# Altium project FM_TX.PrjPcb
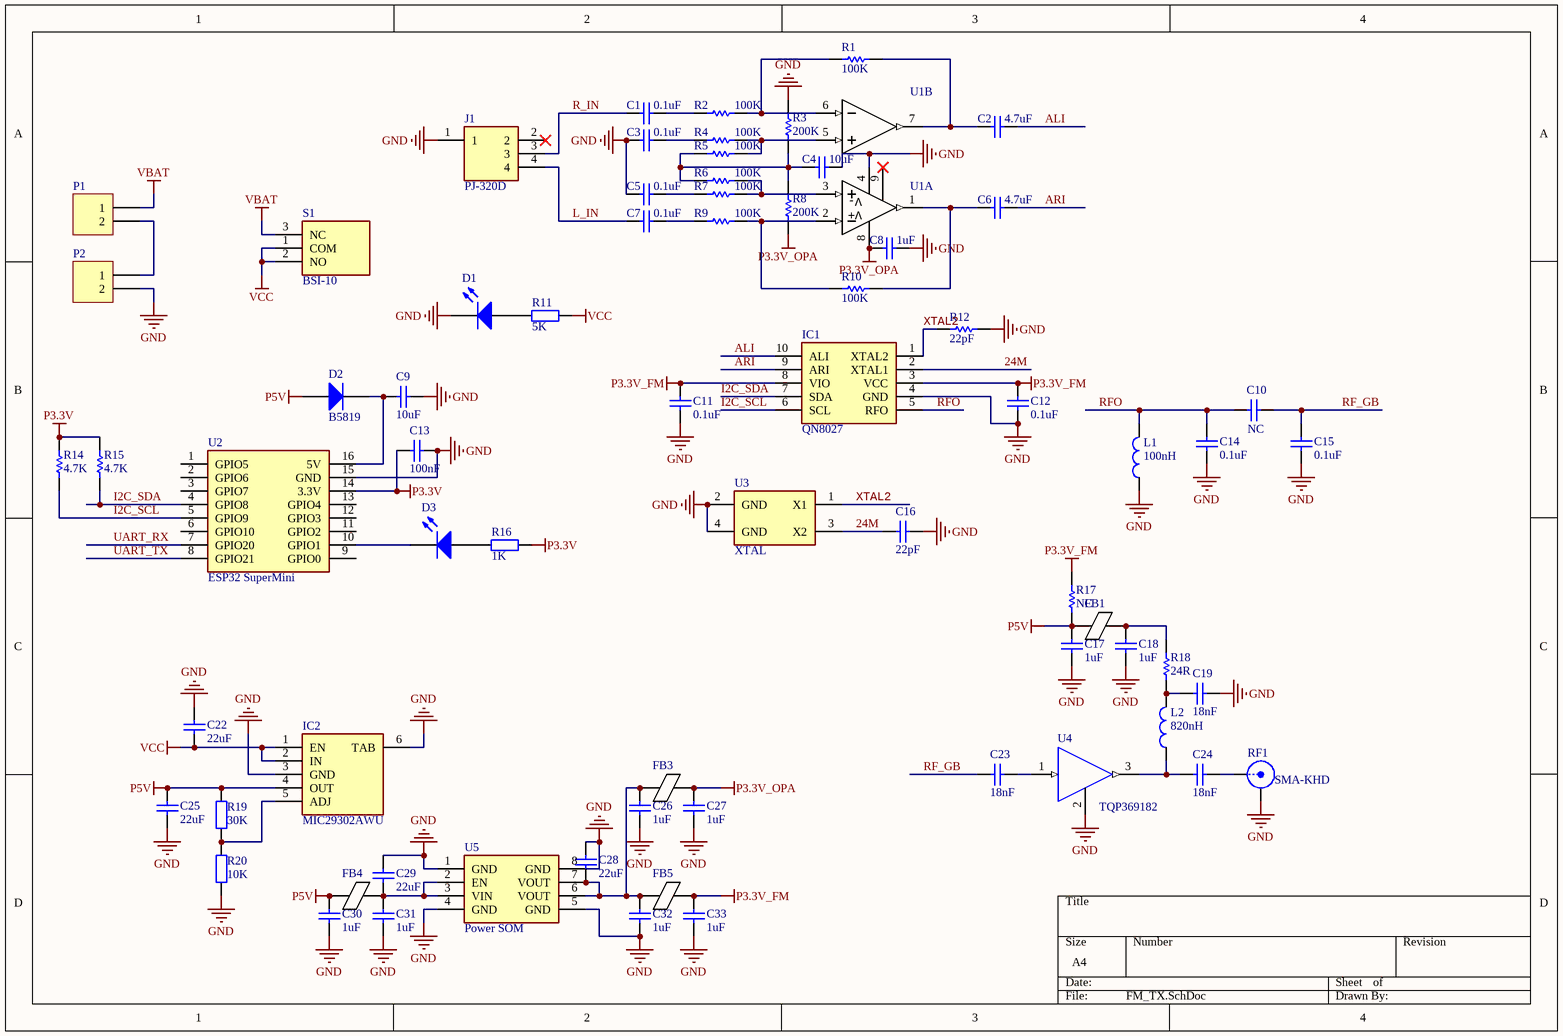
[diagram p0: FM_TX.SchDoc]
1 sheet, 71 parts. Net scope: global (net labels, ports and power ports of the same name join across sheets).
Board file: FM_TX.PcbDoc

## Sheet FM_TX.SchDoc
size A4; SheetNumber: 1; SheetTotal: 1

### Parts
C1  0.1uF  [0603_C]
C2  4.7uF  [0603_C]
C3  0.1uF  [0603_C]
C4  10uF  [0603_C]
C5  0.1uF  [0603_C]
C6  4.7uF  [0603_C]
C7  0.1uF  [0603_C]
C8  1uF  [0603_C]
C9  value 10uF  [C1210]  (hidden comment: Cap)
C10  NC  [0603_C]
C11  0.1uF  [0603_C]
C12  0.1uF  [0603_C]
C13  value 100nF  [C0603]  (hidden comment: Cap)
C14  0.1uF  [0603_C]
C15  0.1uF  [0603_C]
C16  22pF  [0603_C]
C17  1uF  [0603_C]
C18  1uF  [0603_C]
C19  18nF  [0603_C]
C22  value 22uF  [C1210]  (hidden comment: Cap)
C23  18nF  [0603_C]
C24  18nF  [0603_C]
C25  value 22uF  [C1210]  (hidden comment: Cap)
C26  1uF  [0603_C]
C27  1uF  [0603_C]
C28  value 22uF  [C1210]  (hidden comment: Cap)
C29  value 22uF  [C1210]  (hidden comment: Cap)
C30  1uF  [0603_C]
C31  1uF  [0603_C]
C32  1uF  [0603_C]
C33  1uF  [0603_C]
D1  LED  [LED 0603B]  (value not drawn)
D2  B5819  [SOD123]
D3  LED  [LED 0603B]  (value not drawn)
FB1  600Ω @ 100MHz  [0603]  (value not drawn)
FB3  600Ω @ 100MHz  [0603]  (value not drawn)
FB4  600Ω @ 100MHz  [0603]  (value not drawn)
FB5  600Ω @ 100MHz  [0603]  (value not drawn)
IC1  QN8027  [SOP50P490X110-10N]
IC2  MIC29302AWU  [KTT0005B]
J1  PJ-320D  [PJ320D]
L1  100nH  [0805]
L2  820nH  [0805]
P1  Header 2  [XH2.54-WI-2P]  (value not drawn)
P2  Header 2  [XH2.54-WI-2P]  (value not drawn)
R1  100K  [0603_R]
R2  100K  [0603_R]
R3  200K  [0603_R]
R4  100K  [0603_R]
R5  100K  [0603_R]
R6  100K  [0603_R]
R7  100K  [0603_R]
R8  200K  [0603_R]
R9  100K  [0603_R]
R10  100K  [0603_R]
R11  value 5K  [R0603]  (hidden comment: Res)
R12  22pF  [0603_R]
R14  4.7K  [0603_R]
R15  4.7K  [0603_R]
R16  value 1K  [R0603]  (hidden comment: Res)
R17  NC  [0603_R]
R18  24R  [0603_R]
R19  value 30K  [R0603]  (hidden comment: Res)
R20  value 10K  [R0603]  (hidden comment: Res)
RF1  SMA-KHD  [SMA-2]
S1  BSI-10  [BSI10]
U1  OPA2211AIDRGR  [SOIC-8]  (value not drawn)  (parts A,B of 2)
U2  ESP32 SuperMini  [ESP32C3_MINI]
U3  XTAL  [OSC_KH3225_4P]
U4  TQP369182  [SOT-89]
U5  Power SOM  [7A8300]

### Nets
GND: C3.1 C4.2 C5.1 C8.2 C9.1 C11.1 C12.1 C13.2 C14.1 C15.1 C16.1 C17.1 C18.1 C19.2 C22.1 C25.1 C26.1 C27.1 C28.1 C29.2 C30.1 C31.1 C32.1 C33.1 D1.2(K) IC1.4(GND) IC2.3(GND) IC2.6(TAB) J1.1 L1.1 P2.2 R3.1 R12.2 R20.1 RF1.2 U1.4(V-) U2.15(GND) U3.2(GND) U3.4(GND) U4.2(V-) U5.1(GND) U5.4(GND) U5.5(GND) U5.8(GND)
P3.3V: C13.1 R14.2 R15.2 R16.2 U2.14(3.3V)
P3.3V_FM: C11.2 C12.2 C33.2 FB5.2 IC1.3(VCC) IC1.8(VIO) R17.2
P3.3V_OPA: C8.1 C27.2 FB3.2 R8.1 U1.8(V+)
P5V: C17.2 C25.2 C30.2 D2.1(A) FB1.1 FB4.1 IC2.4(OUT) R17.1 R19.2
VBAT: P1.1 S1.3(NC)
VCC: C22.2 IC2.1(EN) IC2.2(IN) R11.2 S1.1(COM) S1.2(NO)
24M: C16.2 IC1.2(XTAL1) U3.3(X2)
ALI: C2.2 IC1.10(ALI)
ARI: C6.2 IC1.9(ARI)
I2C_SCL: IC1.6(SCL) R14.1 U2.5(GPIO9)
I2C_SDA: IC1.7(SDA) R15.1 U2.4(GPIO8)
L_IN: C7.1 J1.4
R_IN: C1.1 J1.3
RF_GB: C10.1 C15.2 C23.1
RFO: C10.2 C14.2 IC1.5(RFO) L1.2
UART_RX: U2.7(GPIO20)
UART_TX: U2.8(GPIO21)
XTAL2: IC1.1(XTAL2) R12.1 U3.1(X1)
NetC1_2: C1.2 R2.1
NetC2_1: C2.1 R1.2 U1.7(2OUT)
NetC3_2: C3.2 R4.1
NetC4_1: C4.1 R3.2 R5.1 R6.1 R8.2
NetC5_2: C5.2 R7.1
NetC6_1: C6.1 R10.2 U1.1(1OUT)
NetC7_2: C7.2 R9.1
NetC9_2: C9.2 D2.2(K) U2.16(5V)
NetC18_2: C18.2 FB1.2 R18.2
NetC19_1: C19.1 L2.2 R18.1
NetC23_2: C23.2 U4.1(IN+)
NetC24_1: C24.1 L2.1 U4.3(OUT)
NetC24_2: C24.2 RF1.1
NetC26_2: C26.2 C28.2 C32.2 FB3.1 FB5.1 U5.6(VOUT) U5.7(VOUT)
NetC29_1: C29.1 C31.2 FB4.2 U5.2(EN) U5.3(VIN)
NetD1_1: D1.1(A) R11.1
NetD3_1: D3.1(A) R16.1
NetD3_2: D3.2(K) U2.10(GPIO1)
NetIC2_5: IC2.5(ADJ) R19.1 R20.2
NetP1_2: P1.2 P2.1
NetR1_1: R1.1 R2.2 U1.6(2IN-)
NetR4_2: R4.2 R5.2 U1.5(2IN+)
NetR6_2: R6.2 R7.2 U1.3(1IN+)
NetR9_2: R9.2 R10.1 U1.2(1IN-)

Not connected (* = marked no-connect by the designer): J1 2*; U1 9*; U2 1(GPIO5) 2(GPIO6) 3(GPIO7) 6(GPIO10) 9(GPIO0) 11(GPIO2) 12(GPIO3) 13(GPIO4)

### Library data of the parts
C1-C8 C10-C12 C14-C19 C23 C24 C26 C27 C30-C33 = CAP: Capacitor; Value: 104; Published: 8-Jun-2000; LatestRevisionDate: 17-Jul-2002; LatestRevisionNote: Re-released for DXP Platform.; PackageReference: RAD-0.3; Publisher: Altium Limited
C9 C13 C22 C25 C28 C29 = Cap: Capacitor; Published: 8-Jun-2000; LatestRevisionDate: 17-Jul-2002; LatestRevisionNote: Re-released for DXP Platform.; PackageReference: RAD-0.3; Publisher: Altium Limited; PackageDescription: Radial Cap, Thru-Hole; 2 Leads; 0.3 in Pin Spacing
D1 D3 = LED: Typical RED, GREEN, YELLOW, AMBER GaAs LED; Published: 8-Jun-2000; LatestRevisionDate: 17-Jul-2002; LatestRevisionNote: Re-released for DXP Platform.; PackageVersion: Feb-2002; PackageReference: 3.2X1.6X1.1; Publisher: Altium Limited; PackageDescription: SM LED; 2 Flat Leads
D2 = Diode B5819
FB1 FB3-FB5 = FB: 磁珠 600Ω @ 100MHz
IC1 = QN8027: Integrated Circuit; Manufacturer_Name: Quintic; Datasheet Link: https://datasheetspdf.com/datasheet/QN8027.html; Height: 1.1mm; Manufacturer_Part_Number: QN8027
IC2 = MIC29302AWU: Integrated Circuit; Manufacturer_Name: Microchip; Datasheet Link: https://componentsearchengine.com/Datasheets/2/MIC29302AWU.pdf; Height: 4.597mm; Manufacturer_Part_Number: MIC29302AWU; Mouser Part Number: 998-MIC29302AWU; Mouser Price/Stock: https://www.mouser.co.uk/ProductDetail/Microchip-Technology/MIC29302AWU?qs=kh6iOki%2FeLGFJUxUIft7qA%3D%3D; Arrow Part Number: MIC29302AWU; Arrow Price/Stock: https://www.arrow.com/en/products/mic29302awu/microchip-technology?region=europe
J1 = PJ-320D: Connector; Manufacturer_Name: Audio-Technica; Datasheet Link: https://p.globalsources.com/IMAGES/PDT/SPEC/432/K1007154432.pdf; Height: 5.6mm; Manufacturer_Part_Number: PJ-320D
L1 L2 = Inductor
P1 P2 = Header 2: Header, 2-Pin; LatestRevisionDate: 17-Jul-2002; LatestRevisionNote: Re-released for DXP Platform.; Publisher: Altium Limited
R1-R10 R12 R14 R15 R17 R18 = RES: Resistor; Value: 1K; Published: 8-Jun-2000; Revision: July-2002: Re-released for DXP Platform.; Publisher: Altium Limited
R11 R16 R19 R20 = Res: Resistor; Published: 8-Jun-2000; LatestRevisionDate: 29-May-2009; LatestRevisionNote: IPC-7351 Footprint Added.; PackageReference: J1-0603; Publisher: Altium Limited; PackageDescription: Chip Resistor
RF1 = SMA_KHD
S1 = BSI-10: Switch; Manufacturer_Name: Sungmun; Datasheet Link: https://datasheet.datasheetarchive.com/originals/distributors/Datasheets-2/DSA-20618.pdf; Height: 6.4mm; Manufacturer_Part_Number: BSI-10
U1 = OPA2211: Imported; Manufacturer: Texas Instruments; GENERIC_PART_NUMBER: OPA2365; Manufacturer_Part_Number: opa2365_d_8; INDUSTRY_STD_PKG_TYPE: SOIC; FAMILY_NAME: LOW OFFSET VOLTAGE; PIN_COUNT: 8; PACKAGE_DESIGNATOR: D; Datasheet URL: http://www.ti.com/lit/gpn/OPA2365; Vendor: Texas Instruments; RefDes: RefDes; Type: DEV; Value: Value
U3 = XTAL_SMT
U4 = LNA
U5 = TPS7A8300